# Altium schematic sheet can_phy.SchDoc
size A4
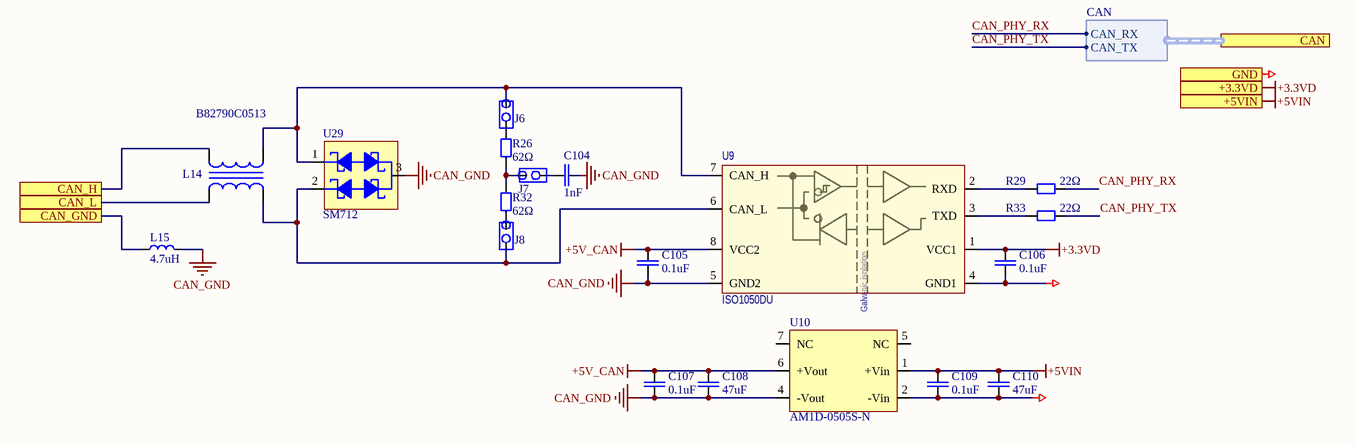
[diagram p0: can_phy.SchDoc]

## Parts
C104  value 1nF  [CAPC3216N]  (hidden comment: 1nF; 2kV)
C105  0.1uF  [CAPC2012N]
C106  0.1uF  [CAPC2012N]
C107  0.1uF  [CAPC2012N]
C108  47uF  [CAPC3216N]
C109  0.1uF  [CAPC2012N]
C110  47uF  [CAPC3216N]
J6  PLS-2  [PLS-2]  (value not drawn)
J7  PLS-2  [PLS-2]  (value not drawn)
J8  PLS-2  [PLS-2]  (value not drawn)
L14  B82790C0513  [SMD_B82790]
L15  value 4.7uH  [IND_3225_MURATA_LQH_N]  (hidden comment: LQH32PN4R7NN0L)
R26  62Ω  [RESC2012N]
R29  22Ω  [RESC1608N]
R32  62Ω  [RESC2012N]
R33  22Ω  [RESC1608N]
U9  ISO1050DU  [SOP8]
U10  AM1D-0505S-N  [SIP-7]
U29  SM712  [SOT95P240X110-3N]

## Ports
+3.3VD, +5VIN, CAN (harness CAN), CAN_GND, CAN_H, CAN_L, GND

## Harnesses
CAN: CAN_TX, CAN_RX

## Nets
+3.3VD: C106.2 U9.1(VCC1) ; port +3.3VD
+5V_CAN: C105.2 C107.2 C108.2 U9.8(VCC2) U10.6(+Vout)
+5VIN: C109.2 C110.2 U10.1(+Vin) ; port +5VIN
CAN_GND: C104.1 C105.1 C107.1 C108.1 L15.2 U9.5(GND2) U10.4(-Vout) U29.3
GND: C106.1 C109.1 C110.1 U9.4(GND1) U10.2(-Vin) ; port GND
CAN_GND: L15.1 ; port CAN_GND  [a separate net that carries the same name]
CAN_H: L14.1 ; port CAN_H
CAN_L: L14.4 ; port CAN_L
CAN_PHY_RX: R29.2 ; port CAN.CAN_RX
CAN_PHY_TX: R33.2 ; port CAN.CAN_TX
NetC104_2: C104.2 J7.2
NetJ6_1: J6.1 L14.2 U9.7(CAN_H) U29.1
NetJ6_2: J6.2 R26.2
NetJ7_1: J7.1 R26.1 R32.2
NetJ8_1: J8.1 R32.1
NetJ8_2: J8.2 L14.3 U9.6(CAN_L) U29.2
NetR29_1: R29.1 U9.2(RXD)
NetR33_1: R33.1 U9.3(TXD)

Not connected (* = marked no-connect by the designer): U10 5(NC) 7(NC)

## Notes on the sheet
- (in symbol ISO1050DU) Galvanic isolation

## Library data of the parts
C104 = CAPC: Generic ceramic SMD capacitor; Pkg: 1206; Maintainer: Evgeniy Kotov; SMD Solders: 2; THD Solders: 0; PartField: 1nF; Last Change Data: 06.03.2017; Release Date: 06.03.2017; VoltageRating: 2kV
C105-C107 C109 = CAPC: Generic ceramic SMD capacitor; Pkg: 0805; Maintainer: Evgeniy Kotov; SMD Solders: 2; THD Solders: 0; PartField: 0.1uF; Last Change Data: 06.03.2017; Release Date: 06.03.2017; Value: 0.1uF
C108 C110 = CAPC: Generic ceramic SMD capacitor; Pkg: 1006; Maintainer: Evgeniy Kotov; SMD Solders: 2; THD Solders: 0; PartField: 47uF; Last Change Data: 06.03.2017; Release Date: 06.03.2017; Value: 47uF
J6-J8 = PLS-2: Connector, 5x2, Male, 2.54mm Pitch, Right Angle; SMD Solders: 0; THD Solders: 2; Maintainer: Evgeniy Kotov; PartField: PLS-2; Last Change Data: 02.04.2017; Release Date: 02.04.2017; Value: PLS-2; ComponentLink1Description: Datasheet; Pkg: PLS-2
L14 = B82790C0513: Pkg: SMD 4 pin; SMD Solders: 4; THD Solders: 0; Vendor: Epcos; PartField: B82790C0513; Value: B82790C0513
L15 = LQH32PN4R7NN0L: Inductor, Fixed, 1210, 4.7uH, 216mOhm, 1A, 30%; Pkg: 1210; Vendor: Murata; Maintainer: Evgeniy Kotov; SMD Solders: 2; THD Solders: 0; DC Current: 750mA; Tolerance: 20%; DC Resistance: 380mΩ; PartField: LQH32PN4R7NN0L; Release Date: 30.03.2017; Last Change Data: 30.03.2017; Temperature Range: -40°C to +105°C
R26 R32 = RESC: Resistor, Generic, SMD; Pkg: 0805; Maintainer: Evgeniy Kotov; SMD Solders: 2; THD Solders: 0; PartField: 62Ω; Release Date: 06.03.2017; Last Change Data: 09.03.2017; Value: 62Ω
R29 R33 = RESC: Resistor, Generic, SMD; Pkg: 0603; Maintainer: Evgeniy Kotov; SMD Solders: 2; THD Solders: 0; PartField: 22Ω; Release Date: 06.03.2017; Last Change Data: 09.03.2017; Value: 22Ω
U9 = ISO1050DU: Order: main; Pkg: SOP-8; SMD Solders: 8; THD Solders: 0; PartField: ISO1050DU; Value: ISO1050DU
U10 = AM1D-0505S-N: AM3G-0505DZ; Manufactuer: Aimtec; SolderOption: 0; Pkg: SIP-7pin; THD Solders: 7; HelpURL: http://www.aimtec.com/site/Aimtec/files/Datasheet/HighResolution/AM1D-NZ.pdf; Manufacturer: Aimtec; PartField: AM1D-0505S-N; Value: AM1D-0505S-N; Vendor: Aimtec; SMD Solders: 0
U29 = SM712: Pkg: SOT23-3; SMD Solders: 3; THD Solders: 0; Vendor: SemTech; ComponentLink1Description: Datasheet; ComponentLink1URL: https://static.chipdip.ru/lib/081/DOC001081416.pdf; Last Change Data: 05.03.2020; PartField: SM712; Value: SM712